# Altium project Control_Board.PrjPcb
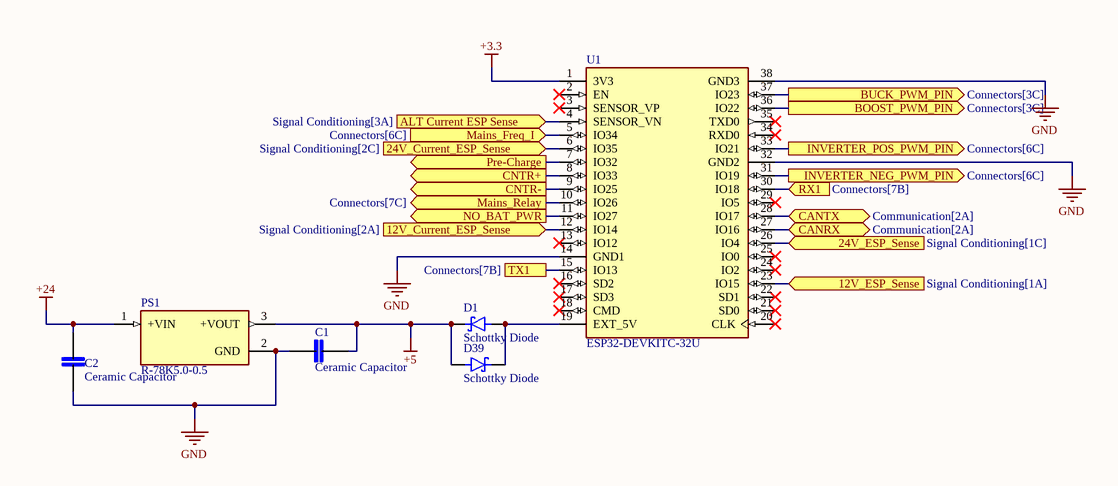
[diagram p0: ESP32.SchDoc]
5 sheets, 55 parts. Net scope: flat (ports and power ports of the same name join across sheets).
Board file: Control_Board.PcbDoc
Sheets:
  ESP32.SchDoc
  driver VCC.SchDoc
  Communication.SchDoc
  Signal Conditioning.SchDoc
  Connectors.SchDoc

## Sheet ESP32.SchDoc
size 381 x 241 mm; SheetNumber: 1; SheetTotal: 5

### Parts
C1  Ceramic Capacitor  [Ceramic Capacitor]
C2  Ceramic Capacitor  [Ceramic Capacitor]
D1  Schottky Diode  [Common Trhough Hole]
D39  Schottky Diode  [Common Trhough Hole]
PS1  R-78K5.0-0.5  [CONV_R-78K5.0-0.5]
U1  ESP32-DEVKITC-32U  [MODULE_ESP32-DEVKITC-32U]

### Ports
12V_Current_ESP_Sense (in, see Signal Conditioning[2A]), 12V_ESP_Sense (in, see Signal Conditioning[1A]), 24V_Current_ESP_Sense (in, see Signal Conditioning[2C]), 24V_ESP_Sense (in, see Signal Conditioning[1C]), ALT Current ESP Sense (in, see Signal Conditioning[3A]), BOOST_PWM_PIN (out, see Connectors[3C]), BUCK_PWM_PIN (out, see Connectors[3C]), CANRX (bidir, see Communication[2A]), CANTX (bidir, see Communication[2A]), CNTR+ (out), CNTR- (out), INVERTER_NEG_PWM_PIN (out, see Connectors[6C]), INVERTER_POS_PWM_PIN (out, see Connectors[6C]), Mains_Freq_I (in, see Connectors[6C]), Mains_Relay (out, see Connectors[7C]), NO_BAT_PWR (out), Pre-Charge (out), RX1 (in, see Connectors[7B]), TX1 (see Connectors[7B])

### Nets
+3.3: U1.1(3V3)
+5: C1.2 D1.1(K) D39.2(A) PS1.3(+VOUT)
+24: C2.2 PS1.1(+VIN)
GND: C1.1 C2.1 PS1.2(GND) U1.14(GND1) U1.32(GND2) U1.38(GND3)
NetC6_P: U1.12(IO14) ; port 12V_Current_ESP_Sense
NetC7_P: U1.4(SENSOR_VN) ; port ALT Current ESP Sense
NetC8_P: U1.23(IO15) ; port 12V_ESP_Sense
NetC9_P: U1.6(IO35) ; port 24V_Current_ESP_Sense
NetC10_P: U1.26(IO4) ; port 24V_ESP_Sense
NetD1_2: D1.2(A) D39.1(K) U1.19(EXT_5V)
NetJ3_3: U1.5(IO34) ; port Mains_Freq_I
NetJ3_4: U1.10(IO26) ; port Mains_Relay
NetJ6_2: U1.30(IO18) ; port RX1
NetJ6_3: U1.15(IO13) ; port TX1
NetJ7_1: U1.31(IO19) ; port INVERTER_NEG_PWM_PIN
NetJ7_3: U1.33(IO21) ; port INVERTER_POS_PWM_PIN
NetJ8_1: U1.37(IO23) ; port BUCK_PWM_PIN
NetJ8_3: U1.36(IO22) ; port BOOST_PWM_PIN
NetJ9_1: U1.7(IO32) ; port Pre-Charge
NetJ9_2: U1.8(IO33) ; port CNTR+
NetJ9_3: U1.9(IO25) ; port CNTR-
NetJ9_4: U1.11(IO27) ; port NO_BAT_PWR
NetU1_27: U1.27(IO16) ; port CANRX
NetU1_28: U1.28(IO17) ; port CANTX

Not connected (* = marked no-connect by the designer): U1 2(EN)* 3(SENSOR_VP)* 13(IO12)* 16(SD2)* 17(SD3)* 18(CMD)* 20(CLK)* 21(SD0)* 22(SD1)* 24(IO2)* 25(IO0)* 29(IO5)* 34(RXD0)* 35(TXD0)*

### Library data of the parts
C1 C2 = Ceramic Capacitor: MP: LD051A121KAB2A; MF: AVX; SnapEDA_Link: https://www.snapeda.com/parts/LD051A121KAB2A/AVX/view-part/?ref=snap; Package: 0805 AVX; Check_prices: https://www.snapeda.com/parts/LD051A121KAB2A/AVX/view-part/?ref=eda; Purchase-URL: https://pricing.snapeda.com/search/part/LD051A121KAB2A/?ref=eda; Price: None; Value: *; Availability: In Stock
D1 D39 = Schottky Diode: MF: Diodes Inc.; MP: 1N5817-T; Package: DO-41 Diodes Inc.; Price: None; Check_prices: https://www.snapeda.com/parts/1N5817-T/Diodes+Inc./view-part/?ref=eda; Value: *; SnapEDA_Link: https://www.snapeda.com/parts/1N5817-T/Diodes+Inc./view-part/?ref=snap; Availability: In Stock; Purchase-URL: https://pricing.snapeda.com/search/part/1N5817-T/?ref=eda
PS1 = R-78K5.0-0.5: 0.5A DC/DC-Converter 'INNOLINE' SIP3 reg; MF: Recom Power; Package: None; Value: *; Check_prices: https://www.snapeda.com/parts/R-78K5.0-0.5/Recom+Power/view-part/?ref=eda; Purchase-URL: https://pricing.snapeda.com/search/part/R-78K5.0-0.5/?ref=eda; Availability: In Stock; SnapEDA_Link: https://www.snapeda.com/parts/R-78K5.0-0.5/Recom+Power/view-part/?ref=snap; Price: None; MP: R-78K5.0-0.5
U1 = ESP32-DEVKITC-32U: ESP32-WROOM-32UE series Transceiver; 802.11 b/g/n (Wi-Fi, WiFi, WLAN), BluetoothÂ® Smart Ready 4.x Dual Mode Evaluation Board; MF: Espressif Systems; SnapEDA_Link: https://www.snapeda.com/parts/ESP32-DEVKITC-32U/Espressif+Systems/view-part/?ref=snap; Availability: In Stock; Purchase-URL: https://pricing.snapeda.com/search/part/ESP32-DEVKITC-32U/?ref=eda; Check_prices: https://www.snapeda.com/parts/ESP32-DEVKITC-32U/Espressif+Systems/view-part/?ref=eda; Value: *; Package: None; MP: ESP32-DEVKITC-32U; Price: None

## Sheet driver VCC.SchDoc
size A4; SheetNumber: 2; SheetTotal: 4
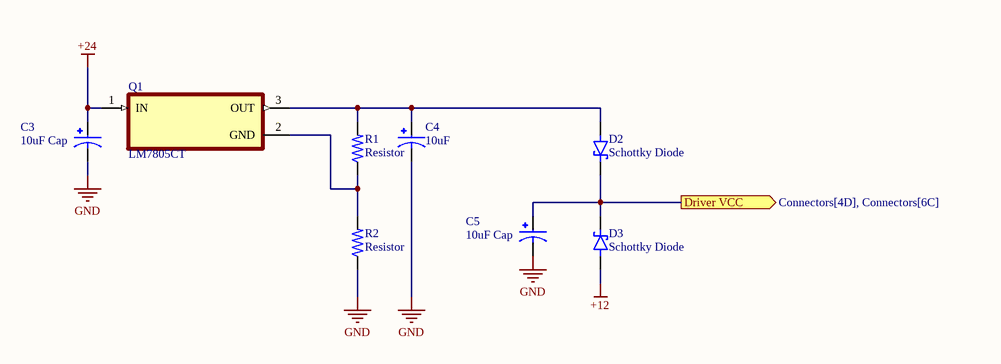
[diagram p1: driver VCC.SchDoc]

### Parts
C3  10uF Cap  [CAP_10uF]
C4  10uF  [CAP_10uF]
C5  10uF Cap  [CAP_10uF]
D2  Schottky Diode  [Common Trhough Hole]
D3  Schottky Diode  [Common Trhough Hole]
Q1  LM7805CT  [LM7805CT]
R1  Resistor  [Resistor_Through Hole]
R2  Resistor  [Resistor_Through Hole]

### Ports
Driver VCC (out, see Connectors[4D], Connectors[6C])

### Nets
+12: D3.2(A)
+24: C3.P Q1.1(IN)
GND: C3.N C4.N C5.N R2.1
NetC4_P: C4.P D2.2(A) Q1.3(OUT) R1.2
NetC5_P: C5.P D2.1(K) D3.1(K) ; port Driver VCC
NetQ1_2: Q1.2(GND) R1.1 R2.2

### Library data of the parts
C3-C5 = 10uF Cap: CAP ALUM 10UF 20% 50V RADIAL; MP: ECE-A1HN100UI; MF: Panasonic; SnapEDA_Link: https://www.snapeda.com/parts/ECE-A1HN100UI/Panasonic/view-part/2321690/?ref=snap; Price: None; Check_prices: https://www.snapeda.com/parts/ECE-A1HN100UI/Panasonic/view-part/2321690/?ref=eda; Value: *; Availability: In Stock; Package: RADIAL-2 Panasonic
D2 D3 = Schottky Diode: MF: Diodes Inc.; MP: 1N5817-T; Package: DO-41 Diodes Inc.; Price: None; Check_prices: https://www.snapeda.com/parts/1N5817-T/Diodes+Inc./view-part/?ref=eda; Value: *; SnapEDA_Link: https://www.snapeda.com/parts/1N5817-T/Diodes+Inc./view-part/?ref=snap; Availability: In Stock; Purchase-URL: https://pricing.snapeda.com/search/part/1N5817-T/?ref=eda
Q1 = LM7805CT: MP: LM7805CT/NOPB; Price: None; Availability: Unavailable; Value: *; Package: None
R1 R2 = Resistor: Power_Rating: .25 W; MP: 2-2176053-0; Tolerance: 1%; Resistance: .33; MF: TE Connectivity; Price: None; Availability: In Stock; EU_RoHS_Compliance: Compliant with Exemptions; Package: 0805; Value: *; SnapEDA_Link: https://www.snapeda.com/parts/2-2176053-0/TE+Connectivity/view-part/?ref=snap; Check_prices: https://www.snapeda.com/parts/2-2176053-0/TE+Connectivity/view-part/?ref=eda

## Sheet Communication.SchDoc
size A4; SheetNumber: 4; SheetTotal: 5
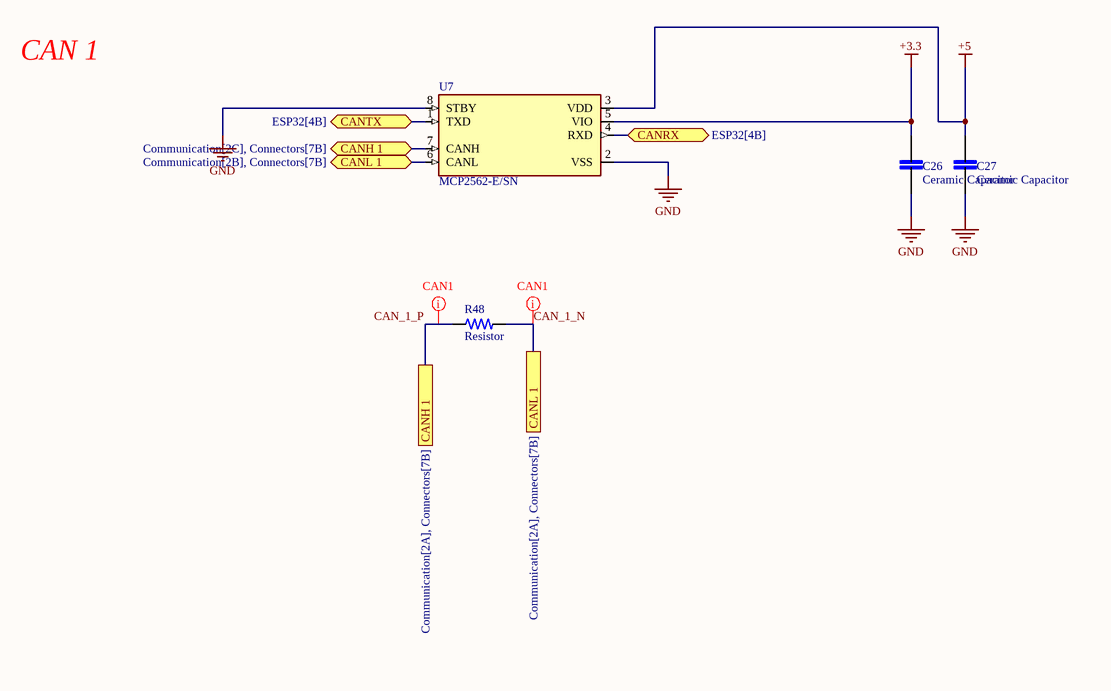
[diagram p2: Communication.SchDoc]

### Parts
C26  Ceramic Capacitor  [Ceramic Capacitor]
C27  Ceramic Capacitor  [Ceramic Capacitor]
R48  Resistor  [Resistor_Through Hole]
U7  MCP2562-E/SN  [MCP2562-E/SN]

### Ports
CANH 1 (bidir, see Communication[2C], Connectors[7B]), CANH 1 (see Communication[2A], Connectors[7B]), CANL 1 (bidir, see Communication[2B], Connectors[7B]), CANL 1 (see Communication[2A], Connectors[7B]), CANRX (bidir, see ESP32[4B]), CANTX (bidir, see ESP32[4B])

### Nets
+3.3: C26.2 U7.5(VIO)
+5: C27.2 U7.3(VDD)
GND: C26.1 C27.1 U7.2(VSS) U7.8(STBY)
CAN_1_N: R48.2 U7.6(CANL) ; port CANL 1
CAN_1_P: R48.1 U7.7(CANH) ; port CANH 1
NetU1_27: U7.4(RXD) ; port CANRX
NetU1_28: U7.1(TXD) ; port CANTX

### Layout directives
differential pair: CAN_1_N, CAN_1_P

### Notes on the sheet
- CAN 1

### Library data of the parts
C26 C27 = Ceramic Capacitor: MP: LD051A121KAB2A; MF: AVX; SnapEDA_Link: https://www.snapeda.com/parts/LD051A121KAB2A/AVX/view-part/?ref=snap; Package: 0805 AVX; Check_prices: https://www.snapeda.com/parts/LD051A121KAB2A/AVX/view-part/?ref=eda; Purchase-URL: https://pricing.snapeda.com/search/part/LD051A121KAB2A/?ref=eda; Price: None; Value: *; Availability: In Stock
R48 = Resistor: as R1 on sheet driver VCC; Price: None; Availability: In Stock; EU_RoHS_Compliance: Compliant with Exemptions; Package: 0805; Value: *; SnapEDA_Link: https://www.snapeda.com/parts/2-2176053-0/TE+Connectivity/view-part/?ref=snap; Check_prices: https://www.snapeda.com/parts/2-2176053-0/TE+Connectivity/view-part/?ref=eda
U7 = MCP2562-E/SN: 1/1 Transceiver Half CANbus 8-SOIC; MF: Microchip; Value: *; Availability: Unavailable; Package: SO-8 Microchip; Price: None; SnapEDA_Link: https://www.snapeda.com/parts/MCP2562-E/SN/Microchip/view-part/1055306/?ref=snap; MP: MCP2562-E/SN

## Sheet Signal Conditioning.SchDoc
size A4; SheetNumber: 4; SheetTotal: 4
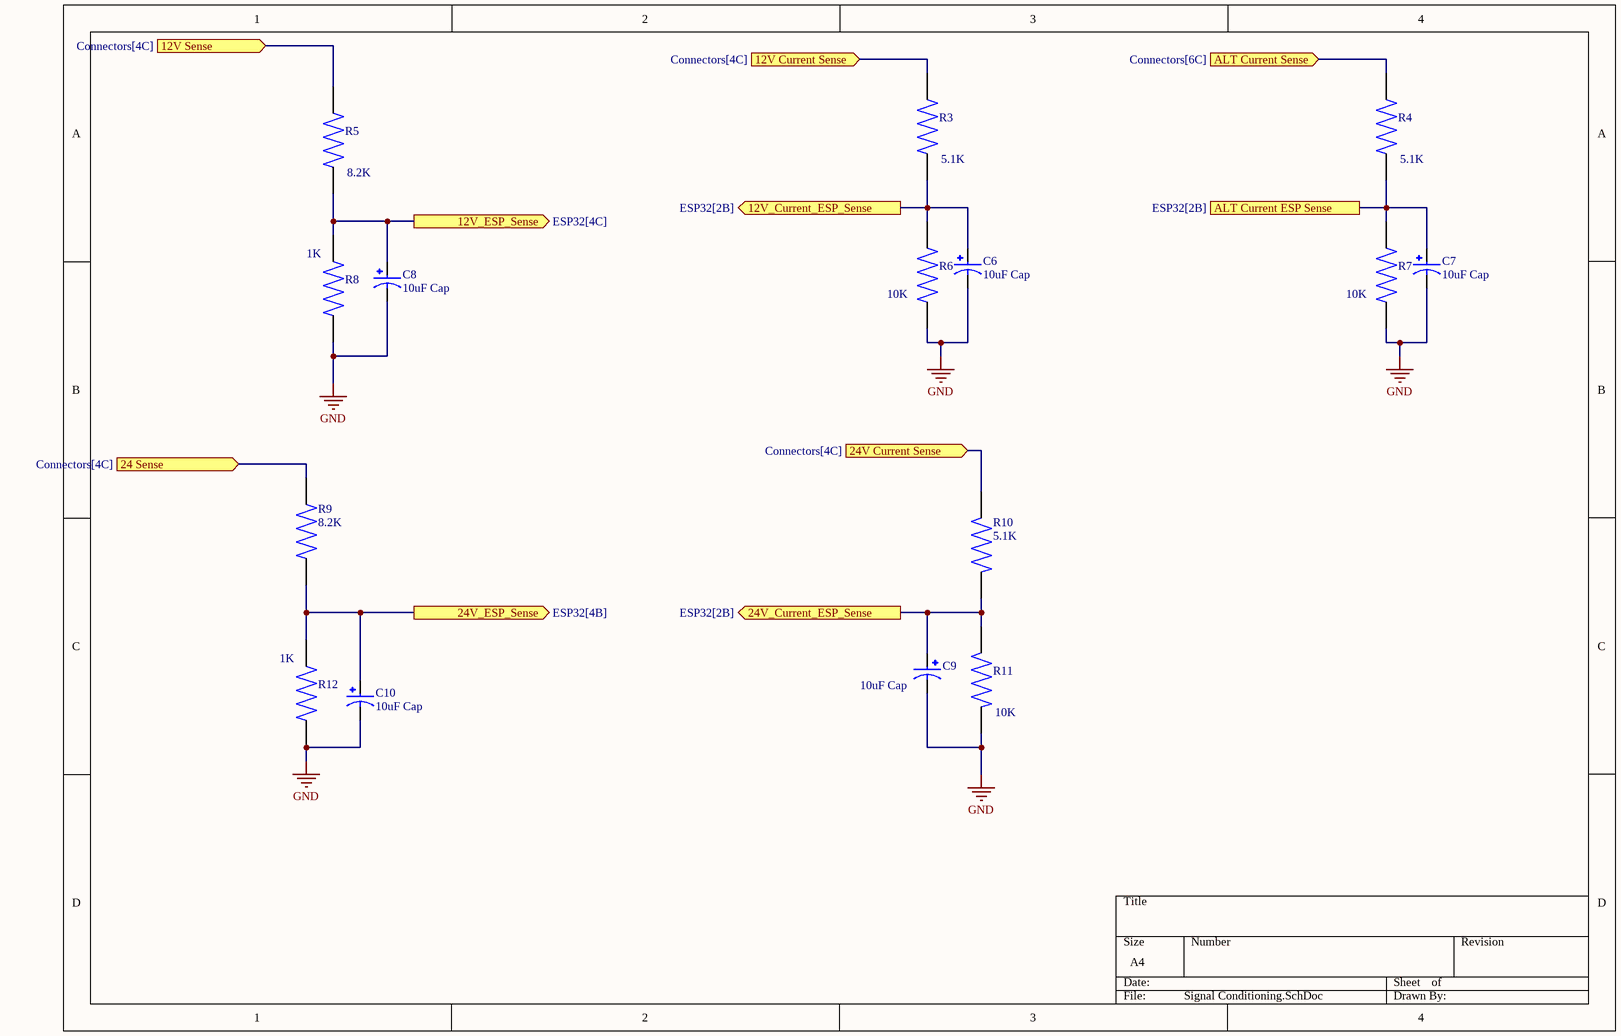
[diagram p3: Signal Conditioning.SchDoc]

### Parts
C6  10uF Cap  [CAP_10uF]
C7  10uF Cap  [CAP_10uF]
C8  10uF Cap  [CAP_10uF]
C9  10uF Cap  [CAP_10uF]
C10  10uF Cap  [CAP_10uF]
R3  5.1K  [Resistor_Through Hole]
R4  5.1K  [Resistor_Through Hole]
R5  8.2K  [Resistor_Through Hole]
R6  10K  [Resistor_Through Hole]
R7  10K  [Resistor_Through Hole]
R8  1K  [Resistor_Through Hole]
R9  8.2K  [Resistor_Through Hole]
R10  5.1K  [Resistor_Through Hole]
R11  10K  [Resistor_Through Hole]
R12  1K  [Resistor_Through Hole]

### Ports
12V Current Sense (in, see Connectors[4C]), 12V Sense (in, see Connectors[4C]), 12V_Current_ESP_Sense (out, see ESP32[2B]), 12V_ESP_Sense (out, see ESP32[4C]), 24 Sense (in, see Connectors[4C]), 24V Current Sense (in, see Connectors[4C]), 24V_Current_ESP_Sense (out, see ESP32[2B]), 24V_ESP_Sense (out, see ESP32[4B]), ALT Current ESP Sense (see ESP32[2B]), ALT Current Sense (in, see Connectors[6C])

### Nets
+12: R5.2 ; port 12V Sense
GND: C6.N C7.N C8.N C9.N C10.N R6.1 R7.1 R8.1 R11.1 R12.1
NetC6_P: C6.P R3.1 R6.2 ; port 12V_Current_ESP_Sense
NetC7_P: C7.P R4.1 R7.2 ; port ALT Current ESP Sense
NetC8_P: C8.P R5.1 R8.2 ; port 12V_ESP_Sense
NetC9_P: C9.P R10.1 R11.2 ; port 24V_Current_ESP_Sense
NetC10_P: C10.P R9.2 R12.2 ; port 24V_ESP_Sense
NetJ2_1: R10.2 ; port 24V Current Sense
NetJ2_3: R9.1 ; port 24 Sense
NetJ2_4: R3.2 ; port 12V Current Sense
NetJ3_1: R4.2 ; port ALT Current Sense

### Library data of the parts
C6-C10 = 10uF Cap: as C3 on sheet driver VCC; SnapEDA_Link: https://www.snapeda.com/parts/ECE-A1HN100UI/Panasonic/view-part/2321690/?ref=snap; Price: None; Check_prices: https://www.snapeda.com/parts/ECE-A1HN100UI/Panasonic/view-part/2321690/?ref=eda; Value: *; Availability: In Stock; Package: RADIAL-2 Panasonic
R3-R12 = Resistor_Through Hole: 1.02 Ohms Â±1% 0.25W, 1/4W Through Hole Resistor Axial Metal Film; MP: MFR-25FTE52-1R; MF: Yageo; Availability: Warning; Value: *; Check_prices: https://www.snapeda.com/parts/MFR-25FTE52-1R/Yageo/view-part/4629919/?ref=eda; Package: Axial Yageo; Price: None; SnapEDA_Link: https://www.snapeda.com/parts/MFR-25FTE52-1R/Yageo/view-part/4629919/?ref=snap; Purchase-URL: https://pricing.snapeda.com/search/part/MFR-25FTE52-1R/?ref=eda

## Sheet Connectors.SchDoc
size A3; SheetNumber: 5; SheetTotal: 4
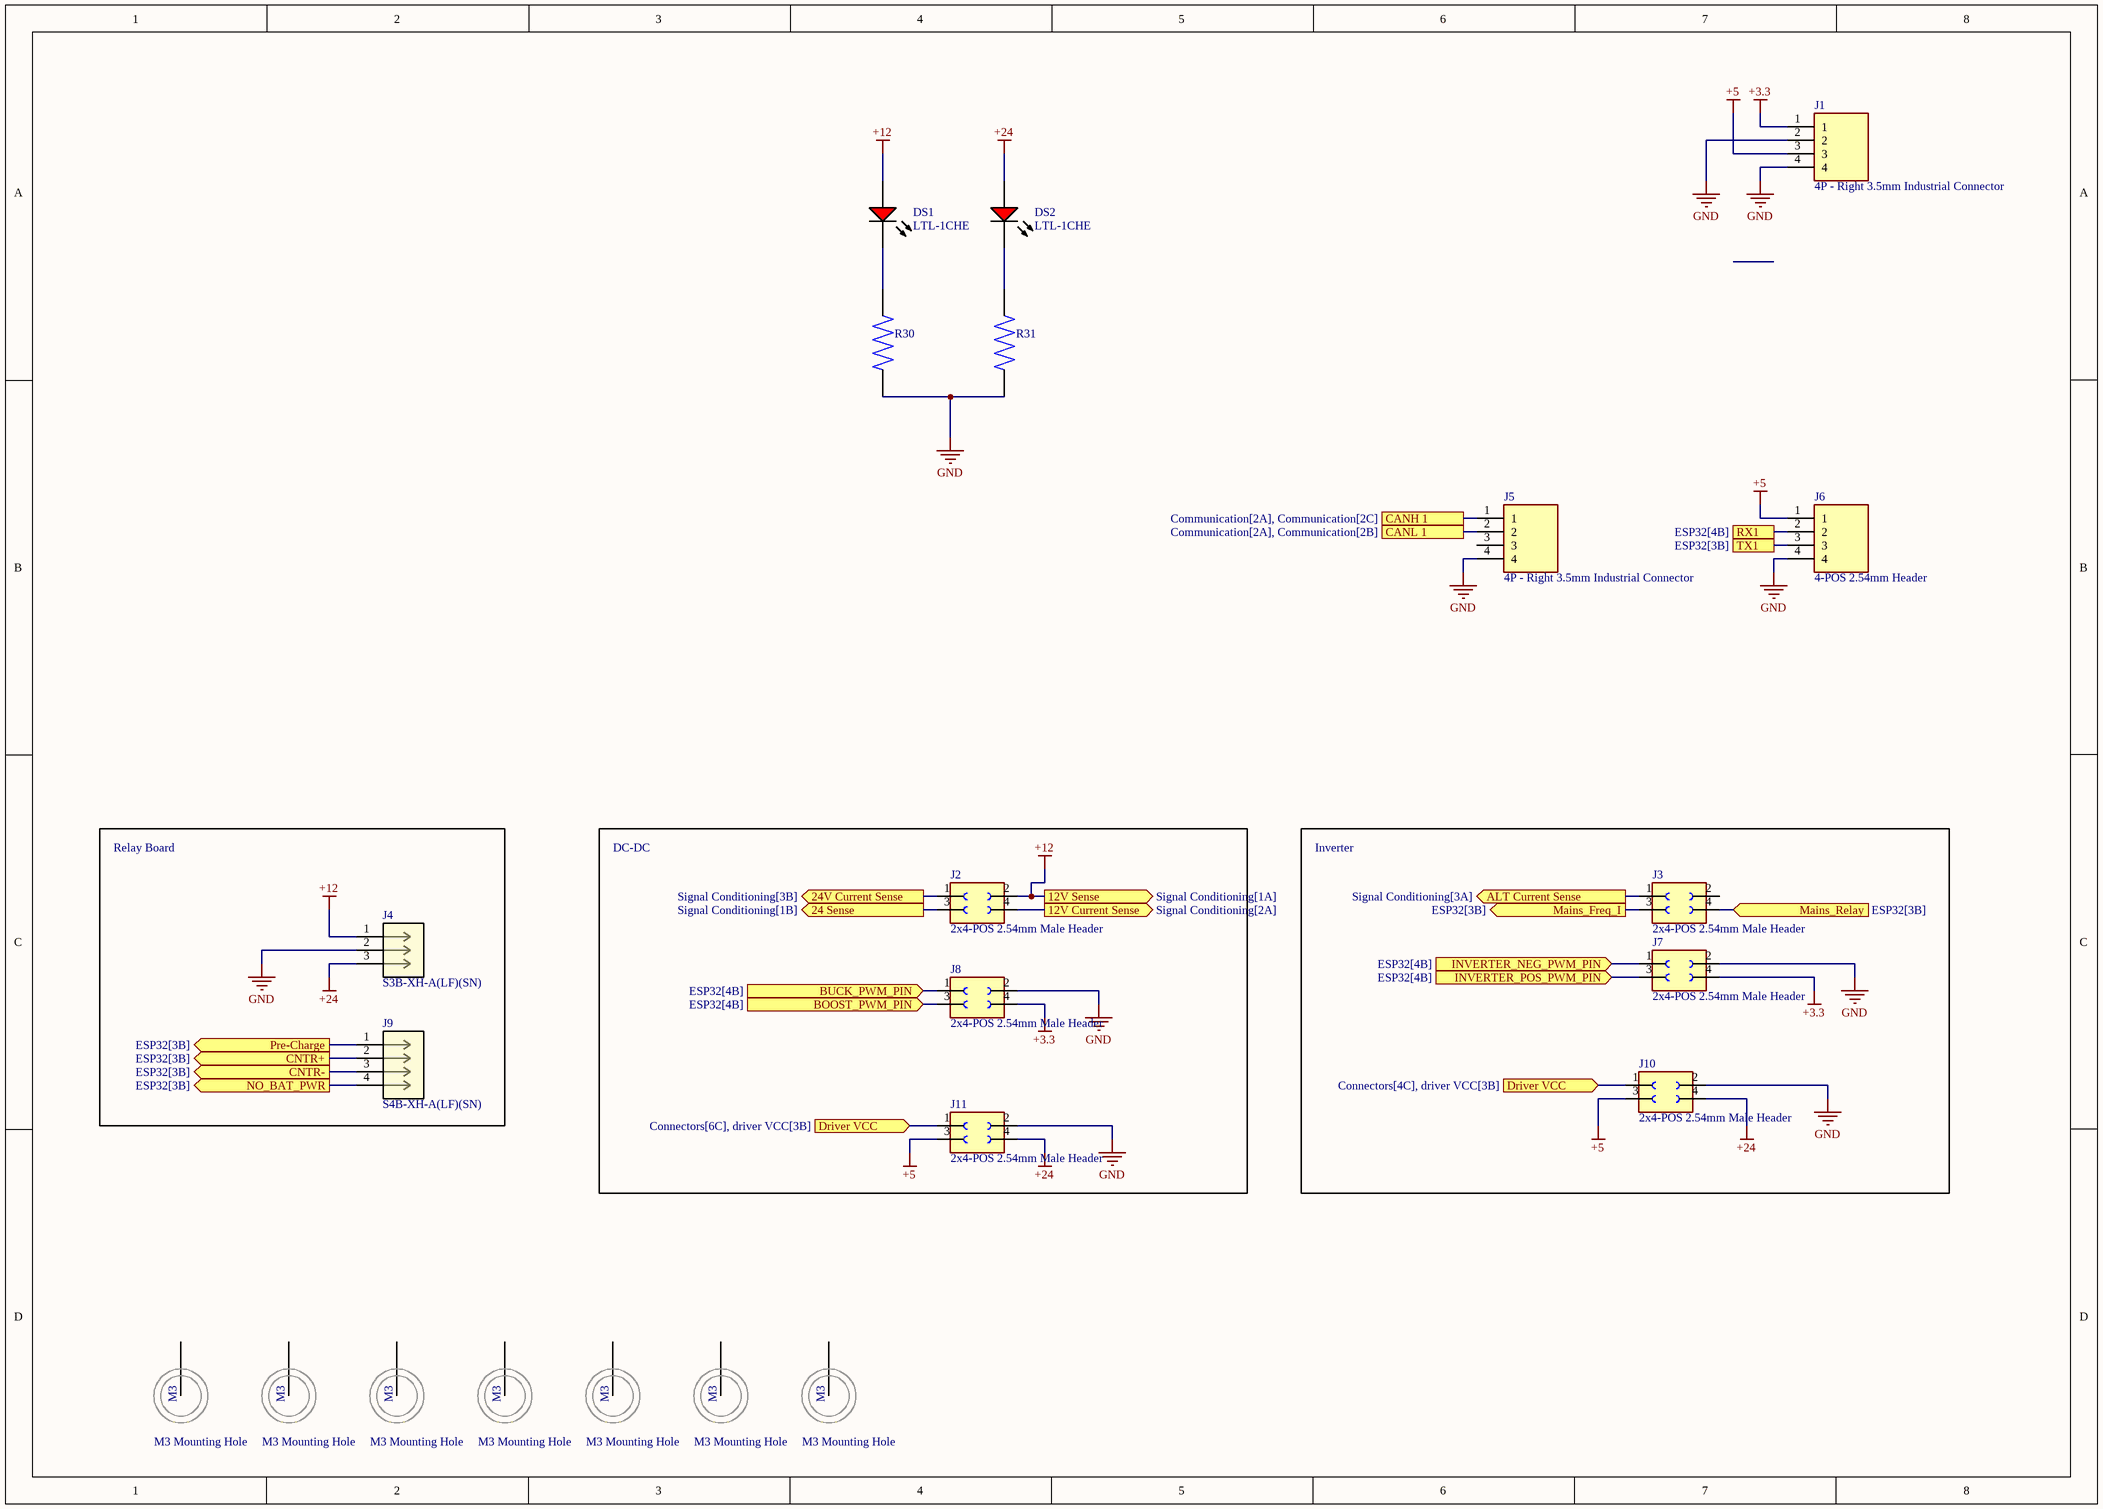
[diagram p4: Connectors.SchDoc]

### Parts
(Parts that share a designator on the sheet are numbered #1, #2 ... from top to bottom, then left to right.)
#1  M3 Mounting Hole  [M3 - Mounting Hole]
#2  M3 Mounting Hole  [M3 - Mounting Hole]
#3  M3 Mounting Hole  [M3 - Mounting Hole]
#4  M3 Mounting Hole  [M3 - Mounting Hole]
?#1  M3 Mounting Hole  [M3 - Mounting Hole]
?#2  M3 Mounting Hole  [M3 - Mounting Hole]
?#3  M3 Mounting Hole  [M3 - Mounting Hole]
DS1  LTL-1CHE  [LED3mm]
DS2  LTL-1CHE  [LED3mm]
J1  4P - Right 3.5mm Industrial Connector  [4P - Right 3.5mm Industrial Connector]
J2  2x4-POS 2.54mm Male Header  [2x4-POS 2.54mm Male Header]
J3  2x4-POS 2.54mm Male Header  [2x4-POS 2.54mm Male Header]
J4  S3B-XH-A(LF)(SN)  [3P JST XH2.54mm 90º]
J5  4P - Right 3.5mm Industrial Connector  [4P - Right 3.5mm Industrial Connector]
J6  4-POS 2.54mm Header  [4-POS 2.54mm Header]
J7  2x4-POS 2.54mm Male Header  [2x4-POS 2.54mm Male Header]
J8  2x4-POS 2.54mm Male Header  [2x4-POS 2.54mm Male Header]
J9  S4B-XH-A(LF)(SN)  [4P JST XH2.54mm 90º]
J10  2x4-POS 2.54mm Male Header  [2x4-POS 2.54mm Male Header]
J11  2x4-POS 2.54mm Male Header  [2x4-POS 2.54mm Male Header]
R30  Resistor_Through Hole  [Resistor_Through Hole]  (value not drawn)
R31  Resistor_Through Hole  [Resistor_Through Hole]  (value not drawn)

### Blocks framed on the sheet
Relay Board: J4 J9
DC-DC: J2 J8 J11
Inverter: J3 J7 J10

### Ports
12V Current Sense (out, see Signal Conditioning[2A]), 12V Sense (out, see Signal Conditioning[1A]), 24 Sense (out, see Signal Conditioning[1B]), 24V Current Sense (out, see Signal Conditioning[3B]), ALT Current Sense (out, see Signal Conditioning[3A]), BOOST_PWM_PIN (in, see ESP32[4B]), BUCK_PWM_PIN (in, see ESP32[4B]), CANH 1 (see Communication[2A], Communication[2C]), CANL 1 (see Communication[2A], Communication[2B]), CNTR+ (out, see ESP32[3B]), CNTR- (out, see ESP32[3B]), Driver VCC (in, see Connectors[4C], driver VCC[3B]), Driver VCC (in, see Connectors[6C], driver VCC[3B]), INVERTER_NEG_PWM_PIN (in, see ESP32[4B]), INVERTER_POS_PWM_PIN (in, see ESP32[4B]), Mains_Freq_I (out, see ESP32[3B]), Mains_Relay (in, see ESP32[3B]), NO_BAT_PWR (out, see ESP32[3B]), Pre-Charge (out, see ESP32[3B]), RX1 (see ESP32[4B]), TX1 (see ESP32[3B])

### Nets
+3.3: J1.1 J7.4 J8.4
+5: J1.3 J6.1 J10.3 J11.3
+12: DS1.1(A) J2.2 J4.1 ; port 12V Sense
+24: DS2.1(A) J4.3 J10.4 J11.4
GND: J1.2 J1.4 J4.2 J5.4 J6.4 J7.2 J8.2 J10.2 J11.2 R30.2 R31.2
CAN_1_N: J5.2 ; port CANL 1
CAN_1_P: J5.1 ; port CANH 1
NetC5_P: J10.1 J11.1 ; port Driver VCC
NetDS1_2: DS1.2(K) R30.1
NetDS2_2: DS2.2(K) R31.1
NetJ2_1: J2.1 ; port 24V Current Sense
NetJ2_3: J2.3 ; port 24 Sense
NetJ2_4: J2.4 ; port 12V Current Sense
NetJ3_1: J3.1 ; port ALT Current Sense
NetJ3_3: J3.3 ; port Mains_Freq_I
NetJ3_4: J3.4 ; port Mains_Relay
NetJ6_2: J6.2 ; port RX1
NetJ6_3: J6.3 ; port TX1
NetJ7_1: J7.1 ; port INVERTER_NEG_PWM_PIN
NetJ7_3: J7.3 ; port INVERTER_POS_PWM_PIN
NetJ8_1: J8.1 ; port BUCK_PWM_PIN
NetJ8_3: J8.3 ; port BOOST_PWM_PIN
NetJ9_1: J9.1 ; port Pre-Charge
NetJ9_2: J9.2 ; port CNTR+
NetJ9_3: J9.3 ; port CNTR-
NetJ9_4: J9.4 ; port NO_BAT_PWR

Not connected (* = marked no-connect by the designer): #1 1(M3); #2 1(M3); #3 1(M3); #4 1(M3); ?#1 1(M3); ?#2 1(M3); ?#3 1(M3); J3 2(4); J5 3

### Library data of the parts
DS1 DS2 = RED_LED 3mm: Radial LED, 12.6 mcd, 20 mA, 2 V, -55 to 100 degC, 2-Pin THD, RoHS, Bulk; Shielding: Unshielded; Resistance: 0.045 Ohm; Current Rating: 3.6 A; Tolerance: 20%; PackageReference: LTL-1CHE; PackageDescription: 2-Pin Through Hole Device, Dia 3.8 mm, Pitch 2.54 mm; Case\Package: Radial; Length: 0.97 inch; Width: 0.62 inch; Height: 1.1 inch; Radiation Hardening: No; Lead Pitch: 11.44 mm; ComponentLink1URL: http://www.us.liteon.com/; ComponentLink1Description: Manufacturer URL; RoHSCompliant: true; Packaging: Tray; Mount: Through Hole; Min Operating Temperature: -40 degC; Max Operating Temperature: 130 degC; ComponentLink2URL: https://datasheet.ciiva.com/15117/getdatasheetpartid-187746-15117985.pdf; Package Quantity: 55; ComponentLink2Description: Datasheet; DatasheetVersion: Dec-03
J1 J5 = 4P - Right 3.5mm Industrial Connector: MP: 5-146290-4; Package: None; Price: None; Value: *; Availability: Unavailable
J2 J3 J7 J8 J10 J11 = 2x4-POS 2.54mm Male Header: MF: WÃ¼rth Elektronik; MP: 613004243121; SnapEDA_Link: https://www.snapeda.com/parts/613004243121/W%C3%BCrth%20Elektronik/view-part/1737074/?ref=snap; Check_prices: https://www.snapeda.com/parts/613004243121/W%C3%BCrth%20Elektronik/view-part/1737074/?ref=eda; Availability: Unavailable; Value: *; Price: None; Package: None
J4 = 3P JST XH2.54mm 90º: No Description Available; Mfr_Name: JST; Copyright: Copyright (C) 2024 Ultra Librarian. All rights reserved.; Manufacturer_Part_Number: S3B-XH-A(LF)(SN); RefDes: RefDes; Type: DEV
J6 = 4-POS 2.54mm Header: MP: 5-146290-4; Package: None; Price: None; Value: *; Availability: Unavailable
J9 = 4P JST XH2.54mm 90º: No Description Available; Mfr_Name: JST; Copyright: Copyright (C) 2024 Ultra Librarian. All rights reserved.; Manufacturer_Part_Number: S4B-XH-A(LF)(SN); RefDes: RefDes; Type: DEV
R30 R31 = Resistor_Through Hole: as R3 on sheet Signal Conditioning; Availability: Warning; Value: *; Check_prices: https://www.snapeda.com/parts/MFR-25FTE52-1R/Yageo/view-part/4629919/?ref=eda; Package: Axial Yageo; Price: None; SnapEDA_Link: https://www.snapeda.com/parts/MFR-25FTE52-1R/Yageo/view-part/4629919/?ref=snap; Purchase-URL: https://pricing.snapeda.com/search/part/MFR-25FTE52-1R/?ref=eda

## Nets that join several sheets
+3.3: ESP32 (U1.1), Communication (C26.2 U7.5), Connectors (J1.1 J7.4 J8.4)
+5: ESP32 (C1.2 D1.1 D39.2 PS1.3), Communication (C27.2 U7.3), Connectors (J1.3 J6.1 J10.3 J11.3)
+12: driver VCC (D3.2), Signal Conditioning (R5.2), Connectors (DS1.1 J2.2 J4.1)
+24: ESP32 (C2.2 PS1.1), driver VCC (C3.P Q1.1), Connectors (DS2.1 J4.3 J10.4 J11.4)
GND: ESP32 (6 pins), driver VCC (C3.N C4.N C5.N R2.1), Communication (C26.1 C27.1 U7.2 U7.8), Signal Conditioning (10 pins), Connectors (11 pins)
CAN_1_N: Communication (R48.2 U7.6), Connectors (J5.2)
CAN_1_P: Communication (R48.1 U7.7), Connectors (J5.1)
NetC5_P: driver VCC (C5.P D2.1 D3.1), Connectors (J10.1 J11.1)
NetC6_P: ESP32 (U1.12), Signal Conditioning (C6.P R3.1 R6.2)
NetC7_P: ESP32 (U1.4), Signal Conditioning (C7.P R4.1 R7.2)
NetC8_P: ESP32 (U1.23), Signal Conditioning (C8.P R5.1 R8.2)
NetC9_P: ESP32 (U1.6), Signal Conditioning (C9.P R10.1 R11.2)
NetC10_P: ESP32 (U1.26), Signal Conditioning (C10.P R9.2 R12.2)
NetJ2_1: Signal Conditioning (R10.2), Connectors (J2.1)
NetJ2_3: Signal Conditioning (R9.1), Connectors (J2.3)
NetJ2_4: Signal Conditioning (R3.2), Connectors (J2.4)
NetJ3_1: Signal Conditioning (R4.2), Connectors (J3.1)
NetJ3_3: ESP32 (U1.5), Connectors (J3.3)
NetJ3_4: ESP32 (U1.10), Connectors (J3.4)
NetJ6_2: ESP32 (U1.30), Connectors (J6.2)
NetJ6_3: ESP32 (U1.15), Connectors (J6.3)
NetJ7_1: ESP32 (U1.31), Connectors (J7.1)
NetJ7_3: ESP32 (U1.33), Connectors (J7.3)
NetJ8_1: ESP32 (U1.37), Connectors (J8.1)
NetJ8_3: ESP32 (U1.36), Connectors (J8.3)
NetJ9_1: ESP32 (U1.7), Connectors (J9.1)
NetJ9_2: ESP32 (U1.8), Connectors (J9.2)
NetJ9_3: ESP32 (U1.9), Connectors (J9.3)
NetJ9_4: ESP32 (U1.11), Connectors (J9.4)
NetU1_27: ESP32 (U1.27), Communication (U7.4)
NetU1_28: ESP32 (U1.28), Communication (U7.1)